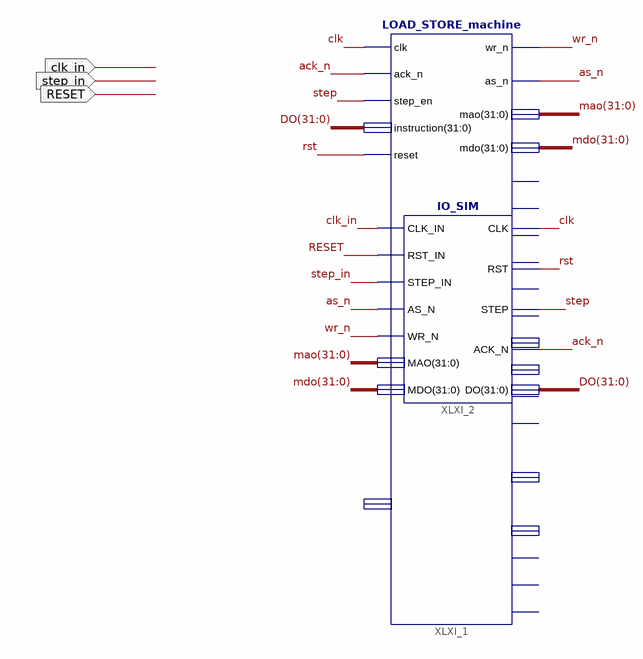
[diagram p0: schematic sheet 1]
// Xilinx ISE schematic load_store_simul.sch (artix7) as structural Verilog: 2 symbols, 3 ports
module load_store_simul (
  input  clk_in,
  input  RESET,
  input  step_in
);

  wire ack_n, as_n, clk, rst, step, wr_n;
  wire [31:0] DO, mao, mdo;

  LOAD_STORE_machine XLXI_1 (
    .clk(clk), .ack_n(ack_n), .step_en(step), .instruction(DO), .reset(rst), .wr_n(wr_n), .as_n(as_n),
    .mao(mao), .mdo(mdo));  // open: Dadr, gpr_we, mux_sel, ir_en, pc_en, ce_regC, ce_regB, MAC_STATE, DLX_CONTROL_STATE, IN_INIT, AEQZ, D, PC, stop_n, MW, MR
  IO_SIM XLXI_2 (
    .CLK_IN(clk_in), .RST_IN(RESET), .STEP_IN(step_in), .AS_N(as_n), .WR_N(wr_n), .MAO(mao), .MDO(mdo),
    .CLK(clk), .RST(rst), .STEP(step), .ACK_N(ack_n), .DO(DO));
endmodule
